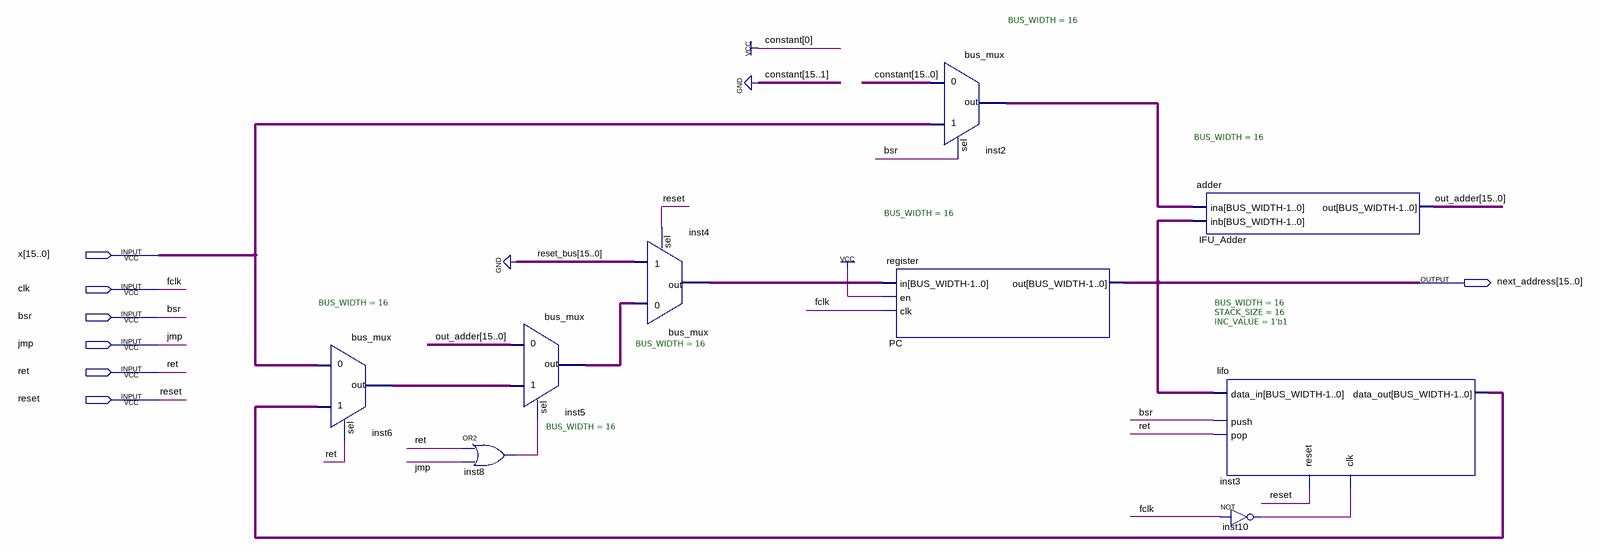
[diagram p0: schematic sheet]
// Quartus schematic ifu.bdf as structural Verilog: 9 symbols, 7 pins
module ifu (
  input  [15:0] x,
  input  clk,
  input  bsr,
  input  jmp,
  input  ret,
  input  reset,
  output [15:0] next_address
);

  wire inst8_out, inst10_out;
  wire [15:0] inst2_out, inst3_data_out, inst4_out, inst5_out, inst6_out, out_adder;

  bus_mux #(.BUS_WIDTH(16)) inst6 (.in0(x), .in1(inst3_data_out), .sel(ret), .out(inst6_out));
  or inst8 (inst8_out, ret, jmp);
  bus_mux #(.BUS_WIDTH(16)) inst5 (.in0(out_adder), .in1(inst6_out), .sel(inst8_out), .out(inst5_out));
  bus_mux #(.BUS_WIDTH(16)) inst4 (.in0(inst5_out), .in1({16{1'b0}}), .sel(reset), .out(inst4_out));
  register #(.BUS_WIDTH(16)) PC (.in(inst4_out), .en(1'b1), .clk(clk), .out(next_address));
  bus_mux #(.BUS_WIDTH(16)) inst2 (.in0(16'b0000000000000001), .in1(x), .sel(bsr), .out(inst2_out));
  adder #(.BUS_WIDTH(16)) IFU_Adder (.ina(inst2_out), .inb(next_address), .out(out_adder));
  lifo #(.BUS_WIDTH(16), .STACK_SIZE(16), .INC_VALUE(1'b1)) inst3 (
    .clk(inst10_out), .reset(reset), .push(bsr), .pop(ret), .data_in(next_address), .data_out(inst3_data_out));
  not inst10 (inst10_out, clk);

  // Other names for the same wires on the sheet: fclk = clk
endmodule
